# Altium schematic sheet Staring_Ver0.1.SchDoc
size A4; SheetNumber: 1; SheetTotal: 1
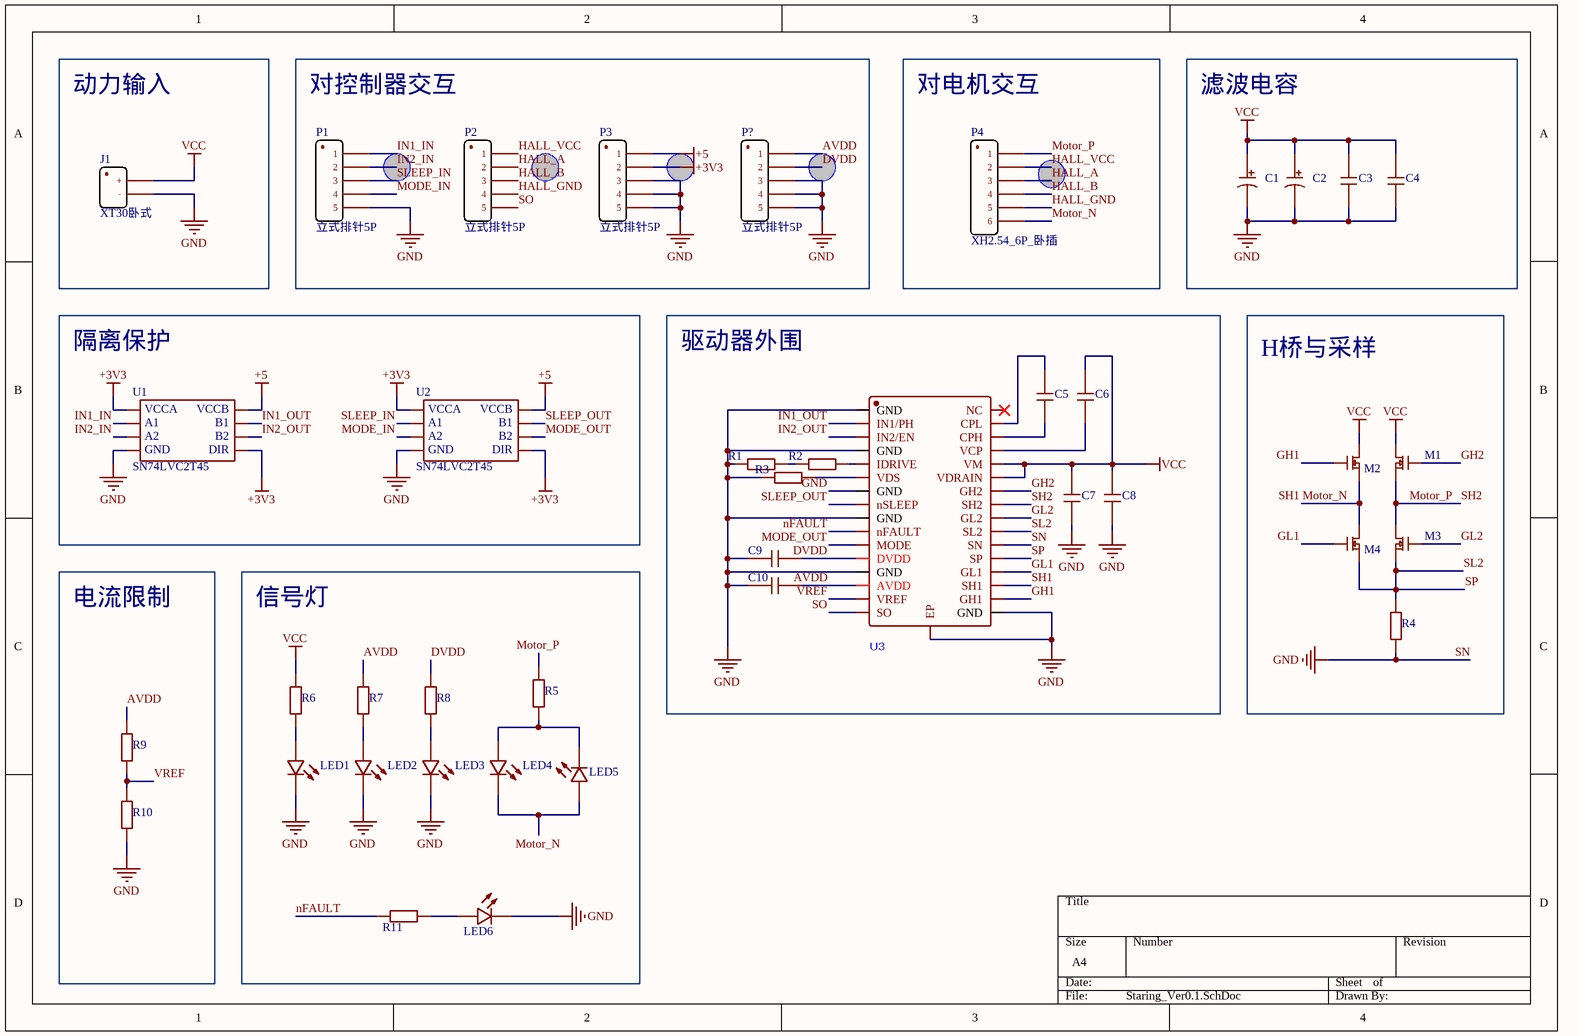
[diagram p0: Staring_Ver0.1.SchDoc]

## Parts
C1  100uF  [SVP6.3]  (value not drawn)
C2  100uF  [SVP6.3]  (value not drawn)
C3  0.1uF  [0805C]  (value not drawn)
C4  0.1uF  [0805C]  (value not drawn)
C5  0.1uF  [0603C]  (value not drawn)
C6  0.1uF  [0603C]  (value not drawn)
C7  0.1uF  [0603C]  (value not drawn)
C8  10uF  [0603C]  (value not drawn)
C9  1uF  [0805C]  (value not drawn)
C10  1uF  [0805C]  (value not drawn)
J1  XT30卧式  [XT30-PW-M]
LED1  LED  [0603D]  (value not drawn)
LED2  LED  [0603D]  (value not drawn)
LED3  LED  [0603D]  (value not drawn)
LED4  LED  [0603D]  (value not drawn)
LED5  LED  [0603D]  (value not drawn)
LED6  LED  [0603D]  (value not drawn)
M1  CSD18502Q5B  [VSON8]  (value not drawn)
M2  CSD18502Q5B  [VSON8]  (value not drawn)
M3  CSD18502Q5B  [VSON8]  (value not drawn)
M4  CSD18502Q5B  [VSON8]  (value not drawn)
P1  立式排针5P  [Pin-PB-M-1*5]
P2  立式排针5P  [Pin-PB-M-1*5]
P3  立式排针5P  [Pin-PB-M-1*5]
P4  XH2.54_6P_卧插  [XH2.54-PW-1*6]
P?  立式排针5P  [Pin-PB-M-1*5]
R1  200k  [0603R]  (value not drawn)
R2  200kNC  [0603R]  (value not drawn)
R3  电阻  [0603R]  (value not drawn)
R4  10m  [2512R]  (value not drawn)
R5  5k  [0603R]  (value not drawn)
R6  18k  [0603R]  (value not drawn)
R7  5k  [0603R]  (value not drawn)
R8  3.3k  [0603R]  (value not drawn)
R9  10k  [0603R]  (value not drawn)
R10  10k  [0603R]  (value not drawn)
R11  5k  [0603R]  (value not drawn)
U1  SN74LVC2T45  [VSSOP8]
U2  SN74LVC2T45  [VSSOP8]
U3  DRV8702  [VQFN32]  (value not drawn)

## Blocks framed on the sheet
动力输入: J1
对控制器交互: P1-P3 P?
对电机交互: P4
滤波电容: C1-C4
隔离保护: U1 U2
驱动器外围: C5-C10 R1-R3 U3
H桥与采样: M1-M4 R4
电流限制: R9 R10
信号灯: LED1-LED6 R5-R8 R11

## Nets
+3V3: P3.2 U1.1 U1.5 U2.1 U2.5
+5: P3.1 U1.8 U2.8
GND: C1.2 C2.2 C3.1 C4.1 C7.1 C8.1 C9.2 C10.2 J1.2 LED1.2 LED2.2 LED3.2 LED6.2 P1.5 P3.3 P3.4 P3.5 P?.3 P?.4 P?.5 R1.1 R3.1 R4.1 R10.1 U1.4 U2.4 U3.1(GND) U3.4(GND) U3.7(GND) U3.9(GND) U3.13(GND) U3.17(GND) U3.22(SN) U3.33(EP)  [also labelled SN]
VCC: C1.1 C2.1 C3.2 C4.2 C6.2 C7.2 C8.2 J1.1 M1.3(Drain) M2.3(Drain) R6.2 U3.27(VDRAIN) U3.28(VM)
AVDD: C10.1 P?.1 R7.2 R9.2 U3.14(AVDD)
DVDD: C9.1 P?.2 R8.2 U3.12(DVDD)
GH1: M2.1(Gate) U3.18(GH1)
GH2: M1.1(Gate) U3.26(GH2)
GL1: M4.1(Gate) U3.20(GL1)
GL2: M3.1(Gate) U3.24(GL2)
HALL_A: P2.2 P4.3
HALL_B: P2.3 P4.4
HALL_GND: P2.4 P4.5
HALL_VCC: P2.1 P4.2
IN1_IN: P1.1 U1.2
IN1_OUT: U1.7 U3.2(IN1/PH)
IN2_IN: P1.2 U1.3
IN2_OUT: U1.6 U3.3(IN2/EN)
MODE_IN: P1.4 U2.3
MODE_OUT: U2.6 U3.11(MODE)
Motor_N: LED4.2 LED5.1 M2.2(Source) M4.3(Drain) P4.6 U3.19(SH1)  [also labelled SH1]
Motor_P: M1.2(Source) M3.3(Drain) P4.1 R5.2 U3.25(SH2)  [also labelled SH2]
nFAULT: R11.2 U3.10(nFAULT)
SL2: M3.2(Source) M4.2(Source) R4.2 U3.21(SP) U3.23(SL2)  [also labelled SP]
SLEEP_IN: P1.3 U2.2
SLEEP_OUT: U2.7 U3.8(nSLEEP)
SO: P2.5 U3.16(SO)
VREF: R9.1 R10.2 U3.15(VREF)
NetC5_1: C5.1 U3.30(CPH)
NetC5_2: C5.2 U3.31(CPL)
NetC6_1: C6.1 U3.29(VCP)
NetLED1_1: LED1.1 R6.1
NetLED2_1: LED2.1 R7.1
NetLED3_1: LED3.1 R8.1
NetLED4_1: LED4.1 LED5.2 R5.1
NetLED6_1: LED6.1 R11.1
NetR1_2: R1.2 R2.1
NetR2_2: R2.2 U3.5(IDRIVE)
NetR3_2: R3.2 U3.6(VDS)

Not connected (* = marked no-connect by the designer): U3 32(NC)*

## Notes on the sheet
- (in symbol 接口_XT) +; -
- (in symbol 芯片/IC-SN74LVC2T45) VCCA; VCCB; A1; B1; A2; B2; GND; DIR

## Library data of the parts
C1 C2 = 电容_贴片电解
C3-C10 = 电容_贴片
J1 = 接口_XT
LED1-LED6 = 二极管_贴片发光
M1-M4 = 场效应管_N沟道
P1-P3 P? = 接插件1*5
P4 = 接插件1*6
R1-R11 = 电阻_贴片
U1 U2 = 芯片/IC-SN74LVC2T45
U3 = 芯片/IC-栅极驱动-DRV8702